# EAGLE schematic Lab 10 - Schematic (EAGLE 9.6.2)
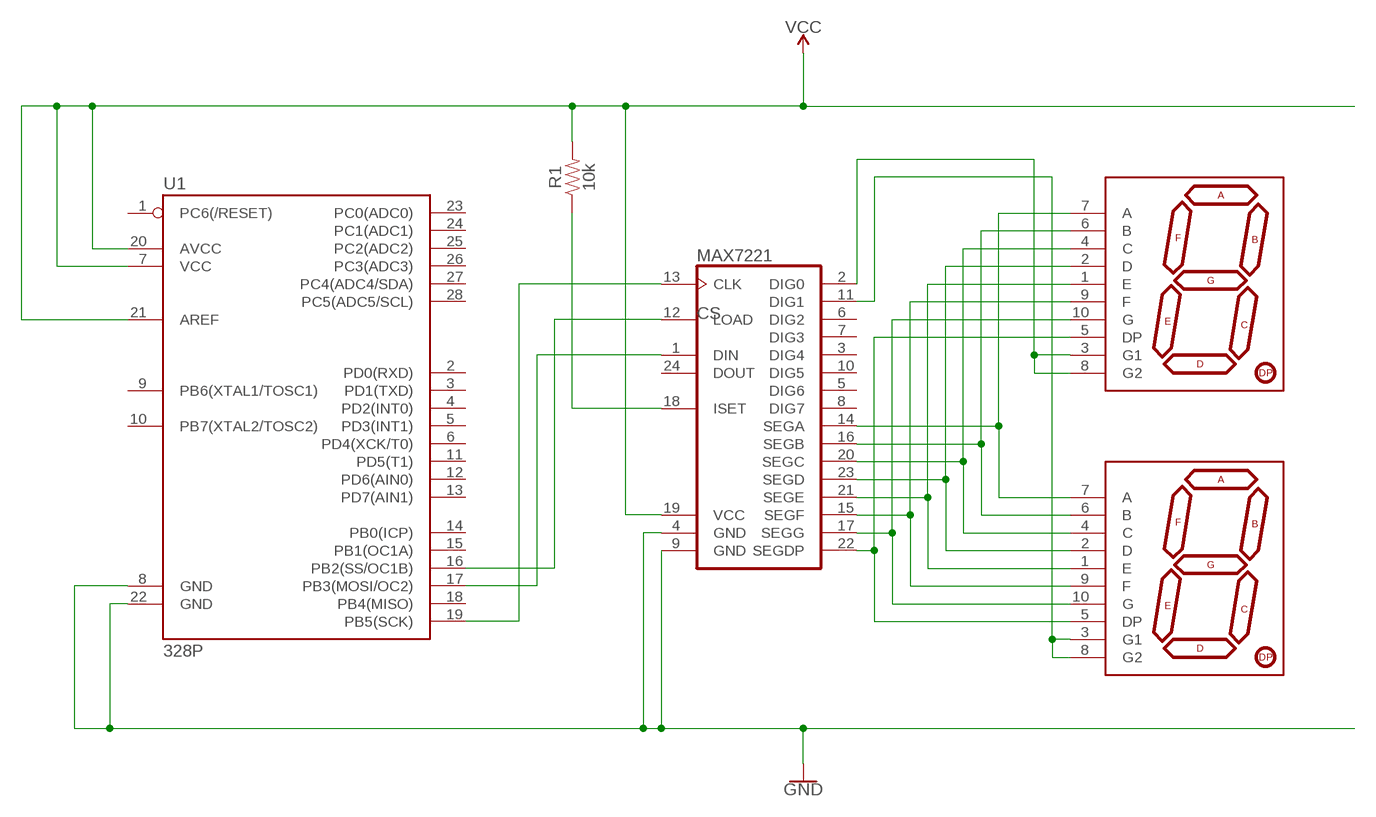
[diagram p0: schematic, sheet 1]

## Parts
MAX7221  MAX7219CNG  [DIL24-3]
R1  10k  10KOHM-HORIZ-1/4W-1%  [AXIAL-0.3]
U1  328P  ATMEGA328P_PDIP  [DIP28]
U$1  YSD-160AB3C-8  7-SEGMENT-1DIGIT-1INCH-BLUE  [7-SEGMENT-1"PTH]
U$2  YSD-160AB3C-8  7-SEGMENT-1DIGIT-1INCH-BLUE  [7-SEGMENT-1"PTH]

## Nets
CS: MAX7221.12(LOAD) U1.16(PB2(SS/OC1B))
GND: MAX7221.4(GND) MAX7221.9(GND) U1.8(GND) U1.22(GND)
N$1: MAX7221.20(SEGC) U$1.4(C) U$2.4(C)
N$2: MAX7221.13(CLK) U1.19(PB5(SCK))
N$3: MAX7221.1(DIN) U1.17(PB3(MOSI/OC2))
N$5: MAX7221.16(SEGB) U$1.6(B) U$2.6(B)
N$6: MAX7221.18(ISET) R1.P$1
N$7: MAX7221.22(SEGDP) U$1.5(DP) U$2.5(DP)
N$8: MAX7221.17(SEGG) U$1.10(G) U$2.10(G)
N$9: MAX7221.15(SEGF) U$1.9(F) U$2.9(F)
N$10: MAX7221.21(SEGE) U$1.1(E) U$2.1(E)
N$11: MAX7221.23(SEGD) U$1.2(D) U$2.2(D)
N$12: MAX7221.14(SEGA) U$1.7(A) U$2.7(A)
N$13: MAX7221.2(DIG0) U$1.3(G1) U$1.8(G2)
N$14: MAX7221.11(DIG1) U$2.3(G1) U$2.8(G2)
VCC: MAX7221.19(VCC) R1.P$2 U1.7(VCC) U1.20(AVCC) U1.21(AREF)
Unconnected: MAX7221.3(DIG4) MAX7221.5(DIG6) MAX7221.6(DIG2) MAX7221.7(DIG3) MAX7221.8(DIG7) MAX7221.10(DIG5) MAX7221.24(DOUT) U1.1(PC6(/RESET)) U1.2(PD0(RXD)) U1.3(PD1(TXD)) U1.4(PD2(INT0)) U1.5(PD3(INT1)) U1.6(PD4(XCK/T0)) U1.9(PB6(XTAL1/TOSC1)) U1.10(PB7(XTAL2/TOSC2)) U1.11(PD5(T1)) U1.12(PD6(AIN0)) U1.13(PD7(AIN1)) U1.14(PB0(ICP)) U1.15(PB1(OC1A)) U1.18(PB4(MISO)) U1.23(PC0(ADC0)) U1.24(PC1(ADC1)) U1.25(PC2(ADC2)) U1.26(PC3(ADC3)) U1.27(PC4(ADC4/SDA)) U1.28(PC5(ADC5/SCL))

## Library data of the parts
MAX7221 = maxim:MAX7219CNG: LED DISPLAY DRIVER; MF: MAXIM; MPN: MAX7219CNG; OC_FARNELL: 1523914; OC_NEWARK: 34C4018
R1 = SparkFun-Resistors:10KOHM: 10kΩ resistor A resistor is a passive two-terminal electrical component that implements electrical resistance as a circuit element. Resistors act to reduce current flow, and, at the same time, act to lower voltage levels within circuits. - Wikipedia; PROD_ID: RES-12183
U1 = SparkFun-IC-Microcontroller:ATMEGA328P_PDIP: Atmel 328P Through hole ATMEGA328P uC used in the Arduino 32kb flash, 1k EEPROM, 2k SRAM Datasheet <http://www.sparkfun.com/datasheets/Components/SMD/ATMega328.pdf> SparkFun Products Storefront component: AVR 28 Pin 20MHz 32K 6A/D - ATMega328P <https://www.sparkfun.com/products/9061> (COM-09061) SparkFun Simon Says - Through-Hole Soldering Kit <https://www.sparkfun.com/products/10547> (KIT-10547) SparkFun Learn to Solder - Simon Says <https://www.sparkfun.com/products/13708> (KIT-13708) SparkFun BigTime Watch Kit <https://www.sparkfun.com/products/11734> (KIT-11734) SparkFun ClockIt <https://www.sparkfun.com/products/10930> (KIT-10930) SparkFun Serial Enabled LCD Kit <https://www.sparkfun.com/products/10097> (LCD-10097) SparkFun Simon Tilts - Through Hole Soldering Kit <https://www.sparkfun.com/products/12634> (KIT-12634) SparkFun Frequency Counter Kit <https://www.sparkfun.com/products/10140> (KIT-10140) FabFM Radio Kit <https://www.sparkfun.com/products/11043> (KIT-11043) SparkFun Binary Blaster Kit <https://www.sparkfun.com/products/12037> (KIT-12037) SparkFun Metro-Gnome <https://www.sparkfun.com/products/9236> (KIT-09236) ATmega328 with Arduino Optiboot (Uno) <https://www.sparkfun.com/products/10524> (DEV-10524); PROD_ID: IC-09136
U$1 U$2 = SparkFun-LED:7-SEGMENT-1DIGIT-1INCH: 7-Segment Display, single digit, 1" EZ is for kits. Pads are only exposed on the bottom side to help prevent soldering in upside down. Datasheet (Red) <https://cdn.sparkfun.com/datasheets/Components/LED/YSD-160AR4B-8.pdf> Datasheet (Blue) <https://cdn.sparkfun.com/datasheets/Components/LED/YSD-160AB3C-8.pdf> SparkFun Products 7-Segment Display - LED (Red) <https://www.sparkfun.com/products/8546> (COM-08546) 7-Segment Display - LED (Blue) <https://www.sparkfun.com/products/9191> (COM-09191); PROD_ID: COMP-09495